# Altium schematic sheet UmbilicalBoardV2.schdoc
size 539 x 193 mm; SheetNumber: 1; SheetTotal: 1
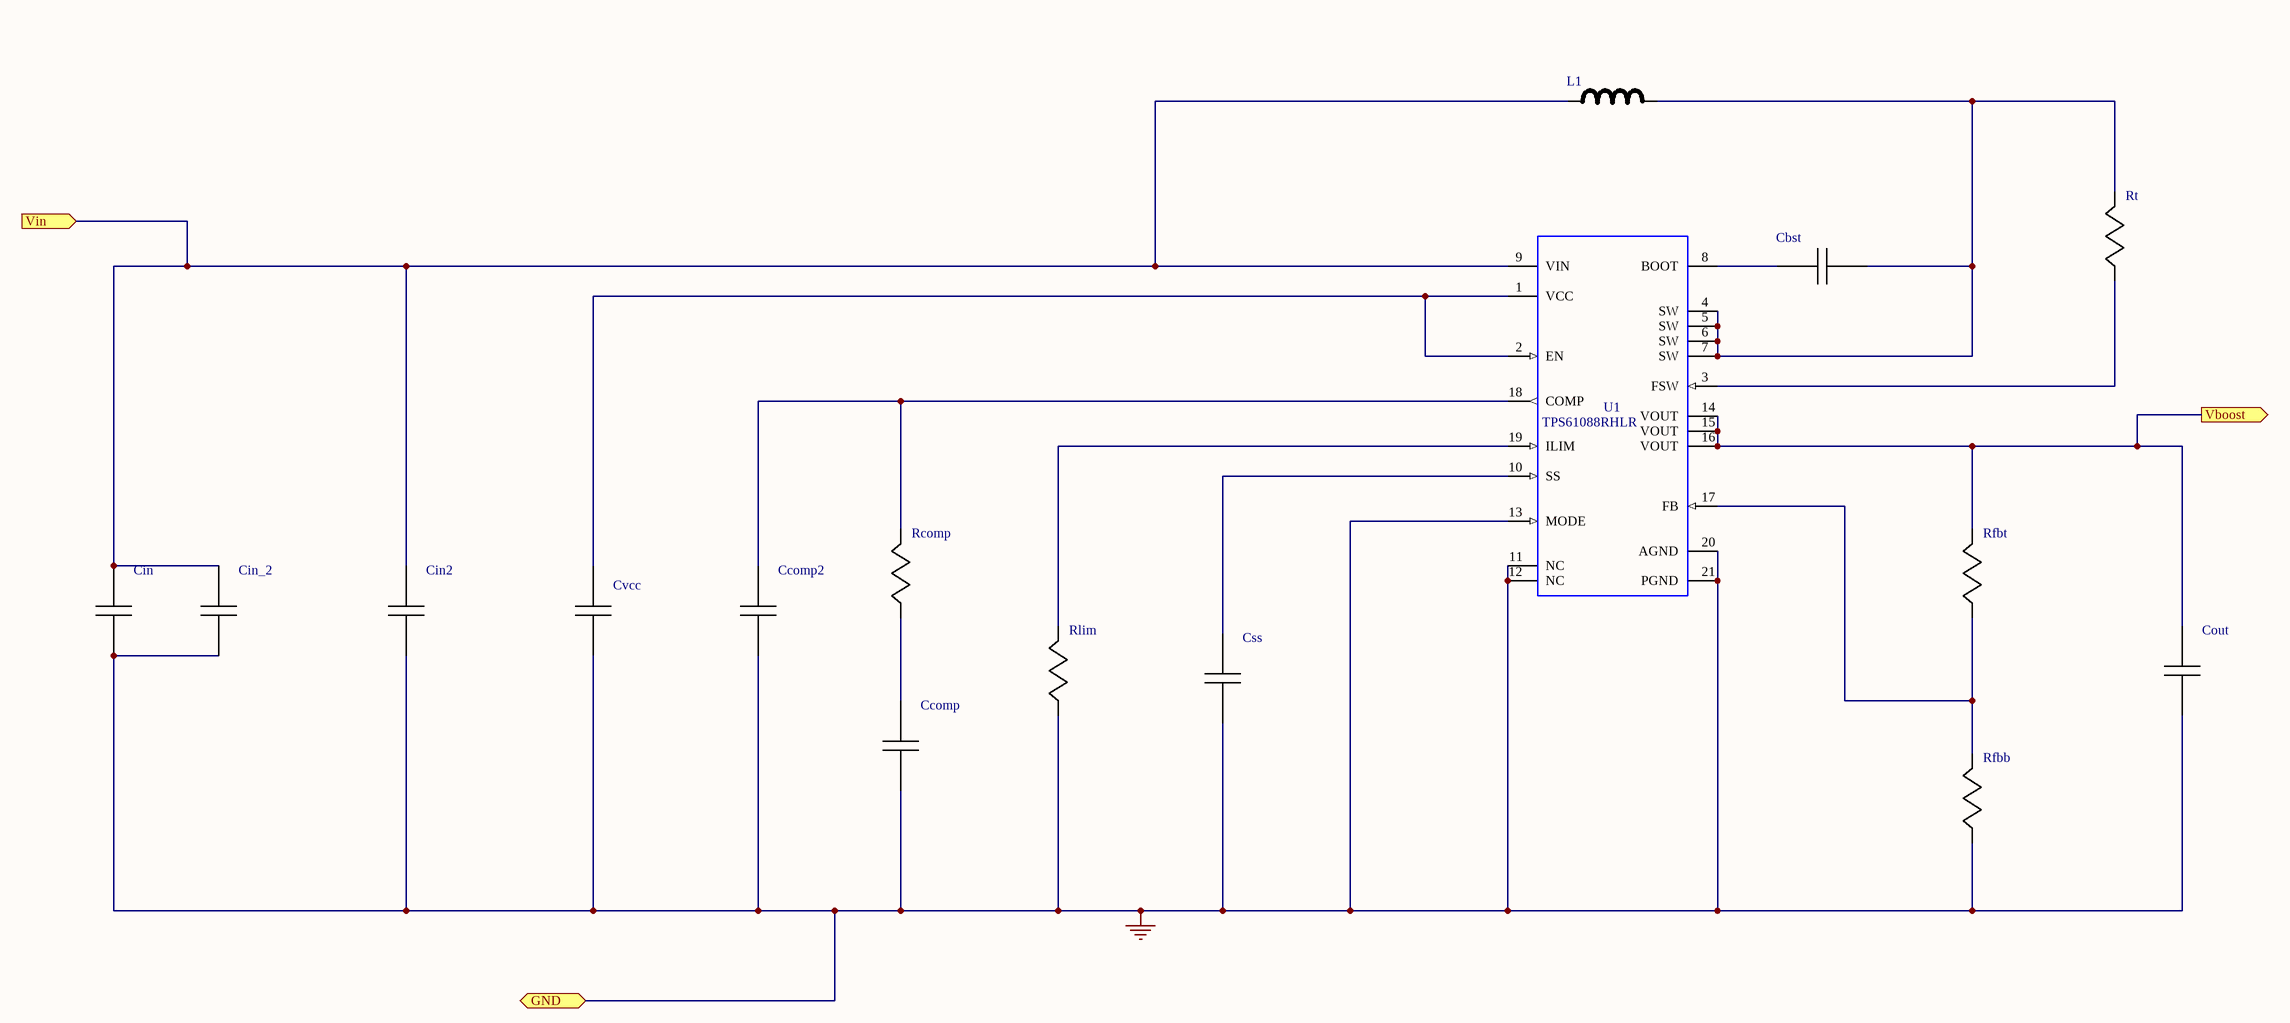
[diagram p0: UmbilicalBoardV2.schdoc]

## Parts
Cbst  C1005X5R1A104K  [1005]  (value not drawn)
Ccomp  02013A220GAT2A  [0201]  (value not drawn)
Ccomp2  CL02C100JO2ANNC  [01005]  (value not drawn)
Cin  GRM188R61C106MA7  [0603]  (value not drawn)
Cin2  GRM155R61C104KA8  [0402]  (value not drawn)
Cin_2  GRM188R61C106MA7  [0603]  (value not drawn)
Cout  C3216X5R1E226M  [1005]  (value not drawn)
Css  GRM155R71C822KA0  [0402]  (value not drawn)
Cvcc  C1608X5R1A105K  [1608]  (value not drawn)
L1  XAL4020-601MEB  [XAL4020]  (value not drawn)
Rcomp  CRCW040249K9FKED  [0402]  (value not drawn)
Rfbb  RC0603FR-0782KL  [0603]  (value not drawn)
Rfbt  CRCW0402732KFKED  [0402]  (value not drawn)
Rlim  ERJ-8ENF1133V  [1206]  (value not drawn)
Rt  RC1206FR-0782KL  [1206]  (value not drawn)
U1  TPS61088RHLR  [RHL0020A]

## Ports
GND (bidir), Vboost (out), Vin (in)

## Nets
0: Ccomp.2 Ccomp2.1 Cin.2 Cin2.2 Cin_2.2 Cout.2 Css.1 Cvcc.1 Rfbb.2 Rlim.2 U1.11(NC) U1.12(NC) U1.13(MODE) U1.20(AGND) U1.21(PGND) ; port GND
Vboost: Cout.1 Rfbt.1 U1.14(VOUT) U1.15(VOUT) U1.16(VOUT) ; port Vboost
Vin: Cin.1 Cin2.1 Cin_2.1 L1.1 U1.9(VIN) ; port Vin
NetCbst_1: Cbst.1 L1.2 Rt.1 U1.4(SW) U1.5(SW) U1.6(SW) U1.7(SW)
NetCbst_2: Cbst.2 U1.8(BOOT)
NetCcomp2_2: Ccomp2.2 Rcomp.1 U1.18(COMP)
NetCcomp_1: Ccomp.1 Rcomp.2
NetCss_2: Css.2 U1.10(SS)
NetCvcc_2: Cvcc.2 U1.1(VCC) U1.2(EN)
NetRfbb_1: Rfbb.1 Rfbt.2 U1.17(FB)
NetRlim_1: Rlim.1 U1.19(ILIM)
NetRt_2: Rt.2 U1.3(FSW)

## Library data of the parts
Cbst = C1005X5R1A104K: Imported; Vendor: TDK; Value: 100nF; Manufacturer_Part_Number: C1005X5R1A104K; RefDes: RefDes; TYPE: TYPE
Ccomp = 02013A220GAT2A: Imported; Vendor: AVX; Value: 220pF; Manufacturer_Part_Number: 02013A220GAT2A; RefDes: RefDes; TYPE: TYPE
Ccomp2 = CL02C100JO2ANNC: Imported; Vendor: Samsung Electro-Mechanics; Value: 10pF; Manufacturer_Part_Number: CL02C100JO2ANNC; RefDes: RefDes; TYPE: TYPE
Cin Cin_2 = GRM188R61C106MA7: Imported; Manufacturer_Part_Number: GRM188R61C106MA73D; Cap: 1.0E-5; ESR: 0; VDC: 16; Vendor: Murata; Value: 10uF; IRMS: 0; RefDes: RefDes; TYPE: TYPE
Cin2 = GRM155R61C104KA8: Imported; Manufacturer_Part_Number: GRM155R61C104KA88D; Vendor: MuRata; Value: 100nF; RefDes: RefDes; TYPE: TYPE
Cout = C3216X5R1E226M: Imported; Vendor: TDK; Value: 22uF; Manufacturer_Part_Number: C3216X5R1E226M; RefDes: RefDes; TYPE: TYPE
Css = GRM155R71C822KA0: Imported; Manufacturer_Part_Number: GRM155R71C822KA01D; Vendor: MuRata; Value: 8.2nF; RefDes: RefDes; TYPE: TYPE
Cvcc = C1608X5R1A105K: Imported; Vendor: TDK; Value: 1uF; Manufacturer_Part_Number: C1608X5R1A105K; RefDes: RefDes; TYPE: TYPE
L1 = XAL4020-601MEB: Imported; Vendor: Coilcraft; Value: 600nH; Manufacturer_Part_Number: XAL4020-601MEB; RefDes: RefDes; TYPE: TYPE
Rcomp = CRCW040249K9FKED: Imported; Res_ohm: 49900; Power_W: 0.063; PartNumber: CRCW040249K9FKED; RefDes: RefDes; TYPE: TYPE; Value: Value
Rfbb = RC0603FR-0782KL: Imported; Vendor: Yageo America; Value: 82000; Manufacturer_Part_Number: RC0603FR-0782KL; RefDes: RefDes; TYPE: TYPE
Rfbt = CRCW0402732KFKED: Imported; Vendor: Vishay-Dale; Value: 732000; Manufacturer_Part_Number: CRCW0402732KFKED; RefDes: RefDes; TYPE: TYPE
Rlim = ERJ-8ENF1133V: Imported; Vendor: Panasonic; Value: 113000; Manufacturer_Part_Number: ERJ-8ENF1133V; RefDes: RefDes; TYPE: TYPE
Rt = RC1206FR-0782KL: Imported; Vendor: Yageo America; Value: 82000; Manufacturer_Part_Number: RC1206FR-0782KL; RefDes: RefDes; TYPE: TYPE
U1 = TPS61088RHLR: Manufacturer Name: Texas Instruments; Value: UNLISTED; PackageReference: TPS61088RHLR; Manufacturer Part Number: TPS61088RHLR